# Altium schematic sheet KEYPAD.SchDoc: Air724UG 参考设计
size 594 x 419 mm; DESIGNER: Loukanghua; REV: V1.0
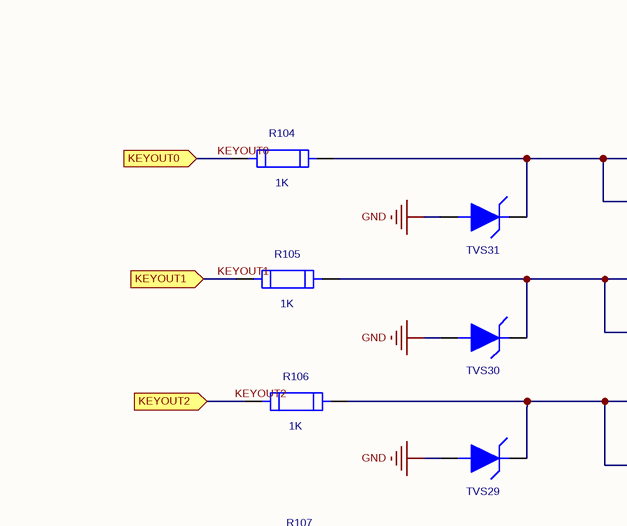
[diagram p0: KEYPAD.SchDoc, top left]
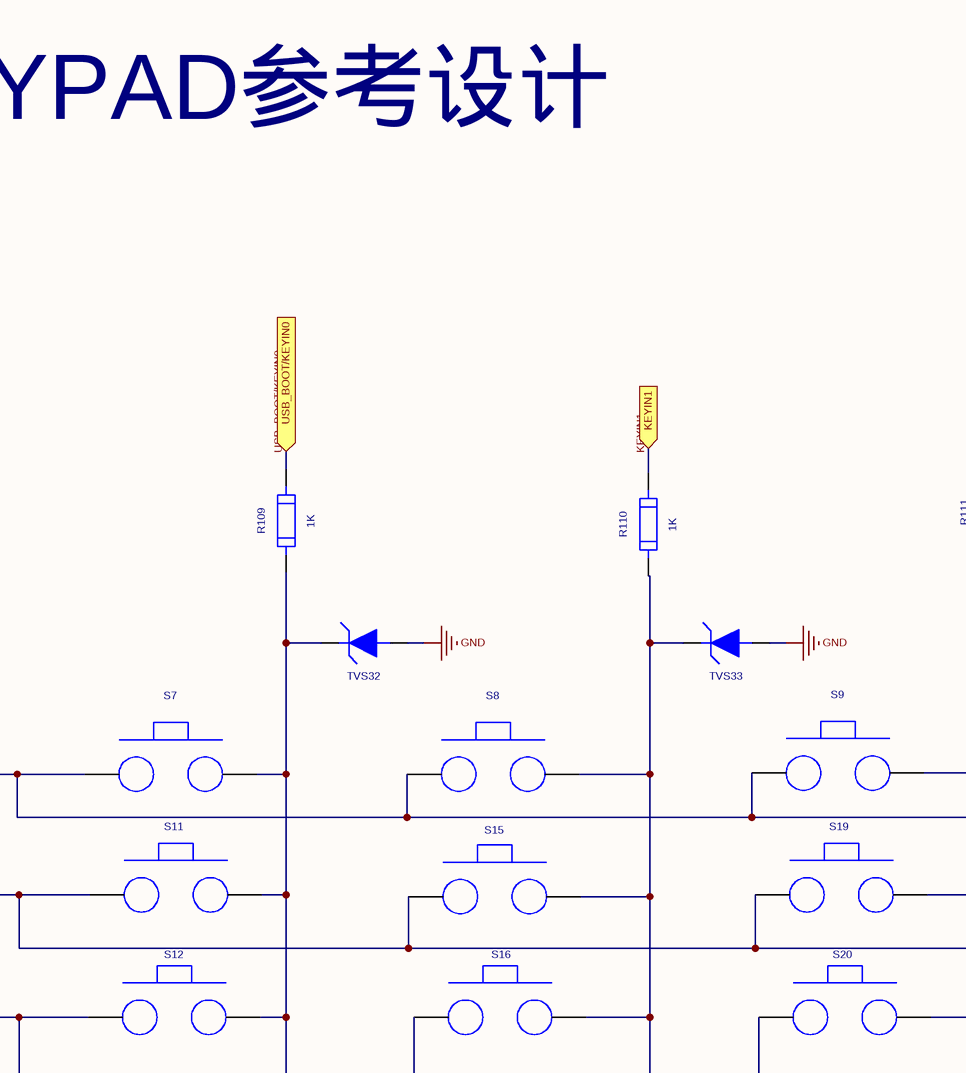
[diagram p1: KEYPAD.SchDoc, top middle]
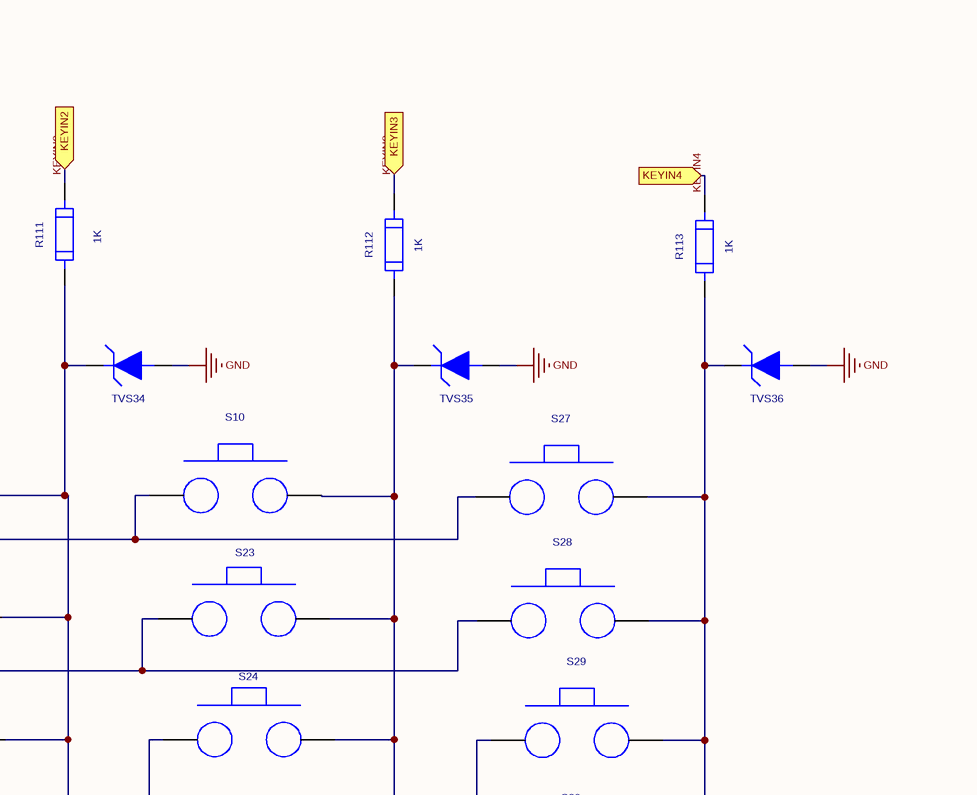
[diagram p2: KEYPAD.SchDoc, top right]
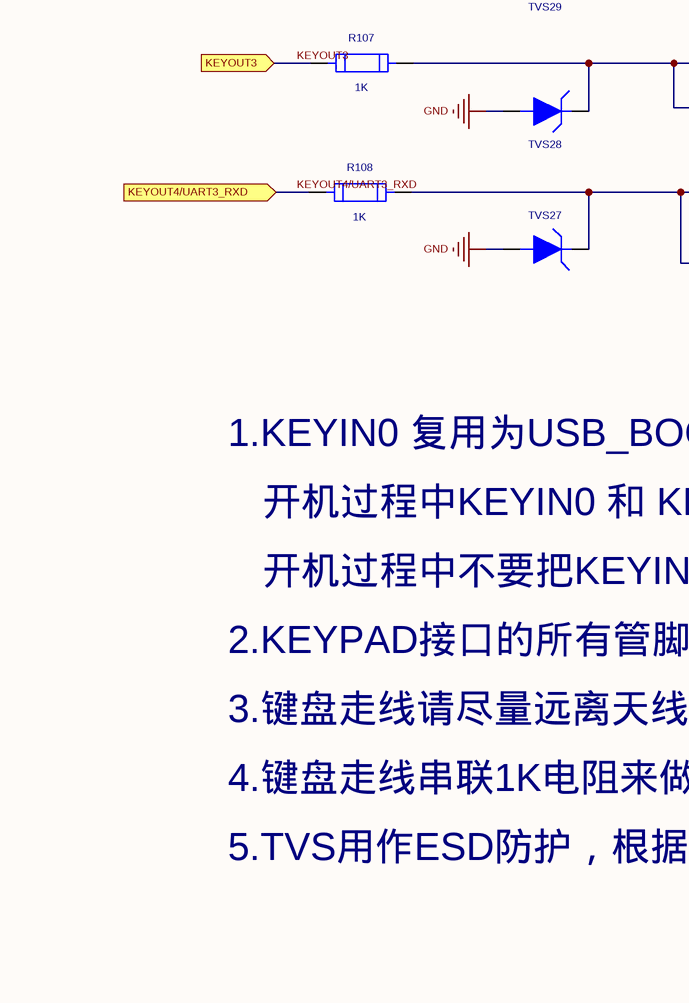
[diagram p3: KEYPAD.SchDoc, bottom left]
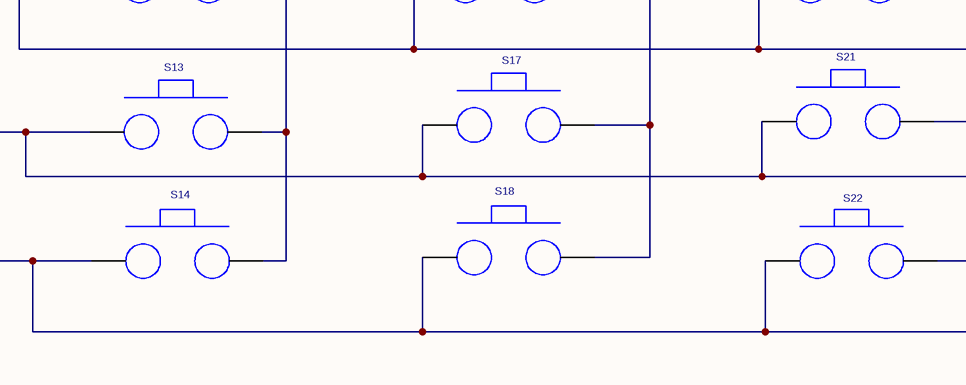
[diagram p4: KEYPAD.SchDoc, bottom middle]
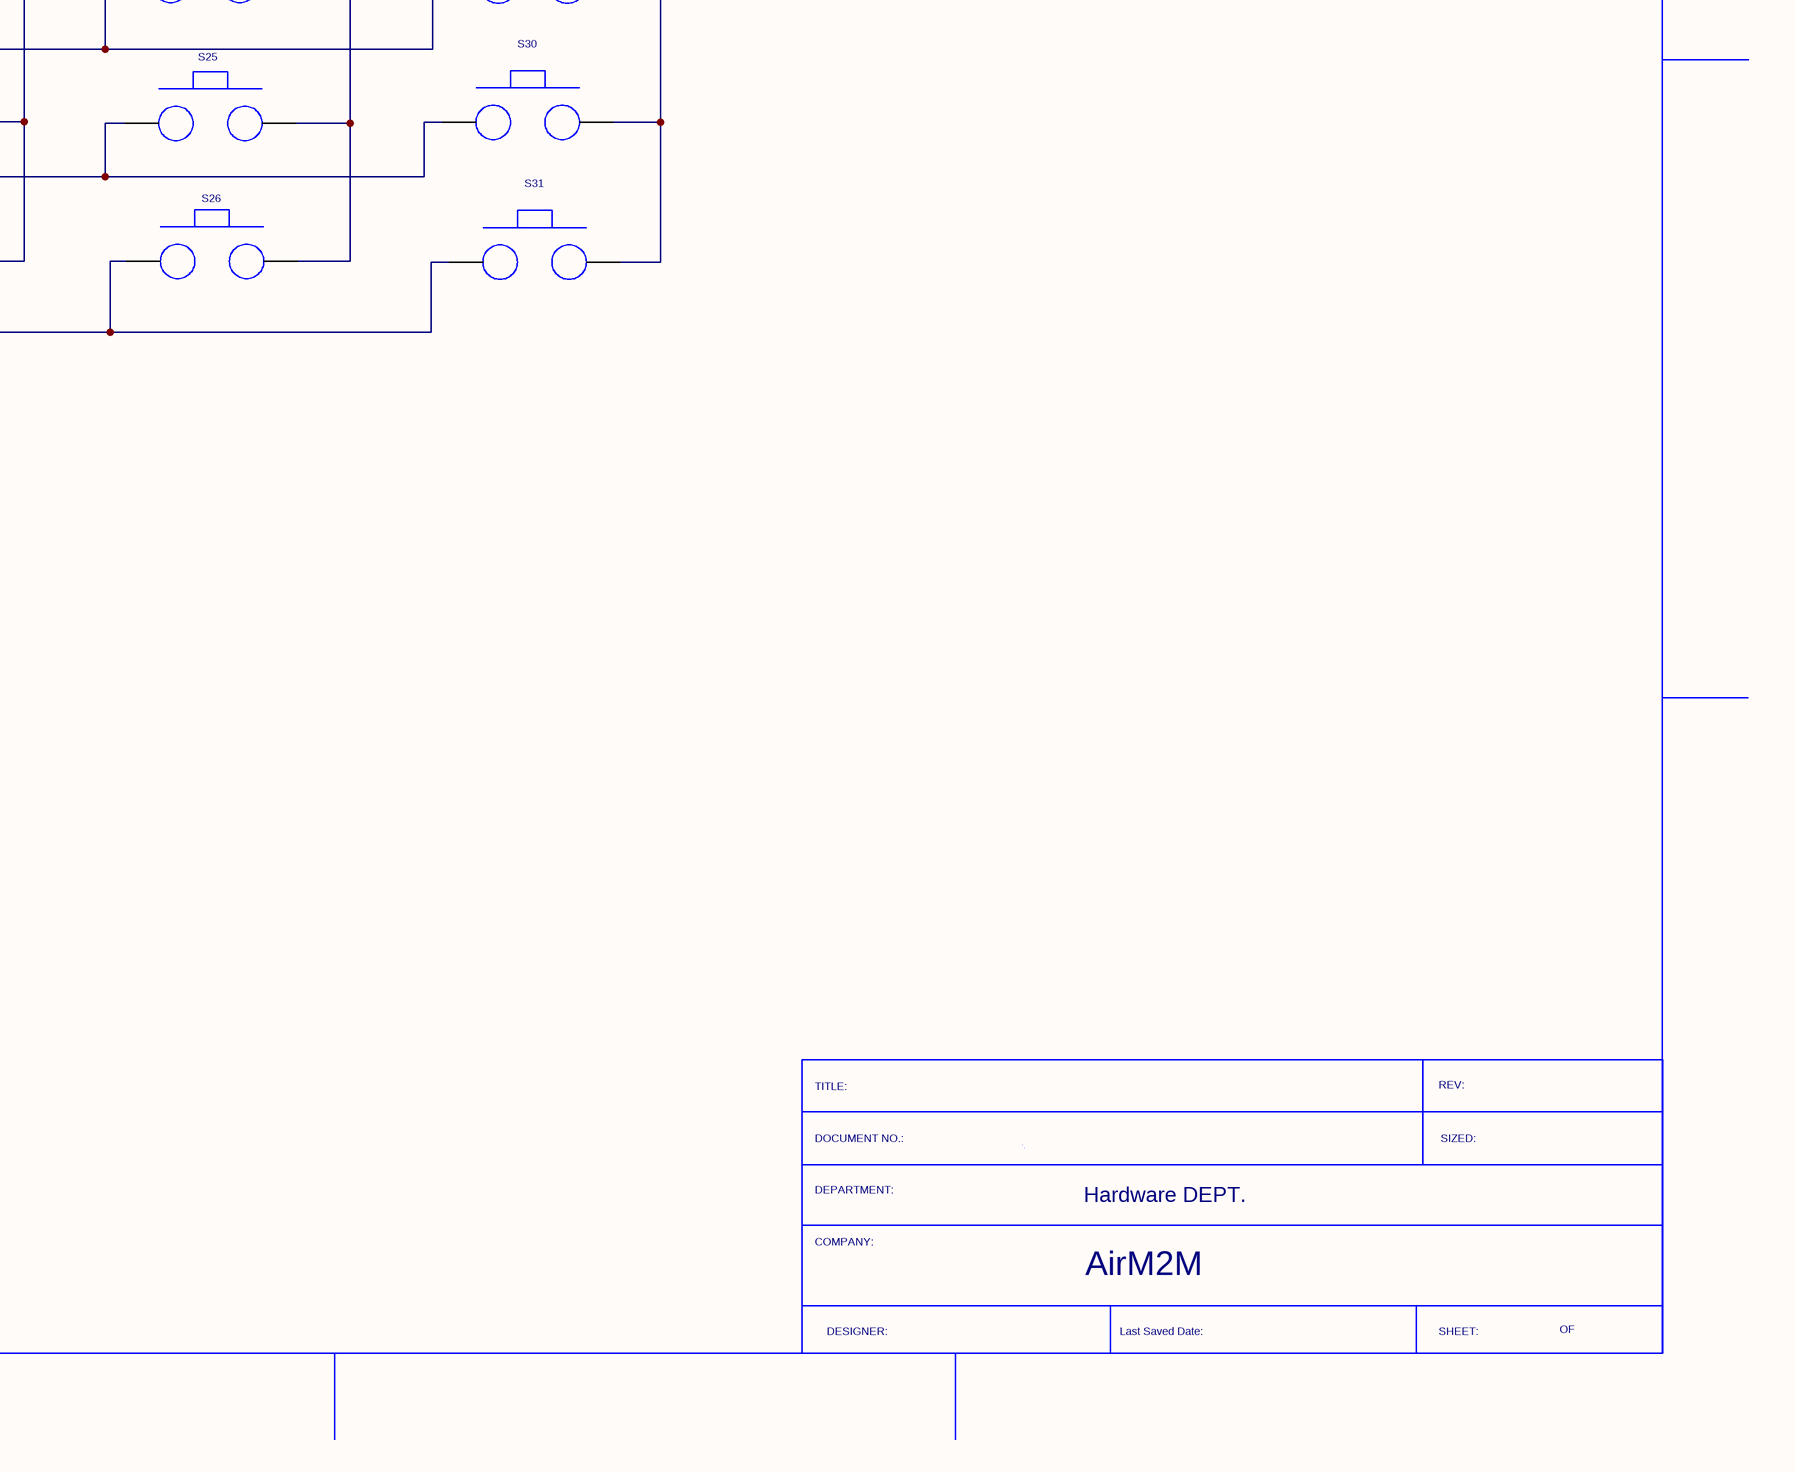
[diagram p5: KEYPAD.SchDoc, bottom right]

## Parts
R104  value 1K  [SR0402]  (hidden comment: RES-1K-+-1%-0402)
R105  value 1K  [SR0402]  (hidden comment: RES-1K-+-1%-0402)
R106  value 1K  [SR0402]  (hidden comment: RES-1K-+-1%-0402)
R107  value 1K  [SR0402]  (hidden comment: RES-1K-+-1%-0402)
R108  value 1K  [SR0402]  (hidden comment: RES-1K-+-1%-0402)
R109  value 1K  [SR0402]  (hidden comment: RES-1K-+-1%-0402)
R110  value 1K  [SR0402]  (hidden comment: RES-1K-+-1%-0402)
R111  value 1K  [SR0402]  (hidden comment: RES-1K-+-1%-0402)
R112  value 1K  [SR0402]  (hidden comment: RES-1K-+-1%-0402)
R113  value 1K  [SR0402]  (hidden comment: RES-1K-+-1%-0402)
S7  KEYPAD-D5X5  [KEY55]  (value not drawn)
S8  KEYPAD-D5X5  [KEY55]  (value not drawn)
S9  KEYPAD-D5X5  [KEY55]  (value not drawn)
S10  KEYPAD-D5X5  [KEY55]  (value not drawn)
S11  KEYPAD-D5X5  [KEY55]  (value not drawn)
S12  KEYPAD-D5X5  [KEY55]  (value not drawn)
S13  KEYPAD-D5X5  [KEY55]  (value not drawn)
S14  KEYPAD-D5X5  [KEY55]  (value not drawn)
S15  KEYPAD-D5X5  [KEY55]  (value not drawn)
S16  KEYPAD-D5X5  [KEY55]  (value not drawn)
S17  KEYPAD-D5X5  [KEY55]  (value not drawn)
S18  KEYPAD-D5X5  [KEY55]  (value not drawn)
S19  KEYPAD-D5X5  [KEY55]  (value not drawn)
S20  KEYPAD-D5X5  [KEY55]  (value not drawn)
S21  KEYPAD-D5X5  [KEY55]  (value not drawn)
S22  KEYPAD-D5X5  [KEY55]  (value not drawn)
S23  KEYPAD-D5X5  [KEY55]  (value not drawn)
S24  KEYPAD-D5X5  [KEY55]  (value not drawn)
S25  KEYPAD-D5X5  [KEY55]  (value not drawn)
S26  KEYPAD-D5X5  [KEY55]  (value not drawn)
S27  KEYPAD-D5X5  [KEY55]  (value not drawn)
S28  KEYPAD-D5X5  [KEY55]  (value not drawn)
S29  KEYPAD-D5X5  [KEY55]  (value not drawn)
S30  KEYPAD-D5X5  [KEY55]  (value not drawn)
S31  KEYPAD-D5X5  [KEY55]  (value not drawn)
TVS27  ESD-TVS-ESD9X5.0ST5G  [SOD-923-ESD9X5.0ST5G]  (value not drawn)
TVS28  ESD-TVS-ESD9X5.0ST5G  [SOD-923-ESD9X5.0ST5G]  (value not drawn)
TVS29  ESD-TVS-ESD9X5.0ST5G  [SOD-923-ESD9X5.0ST5G]  (value not drawn)
TVS30  ESD-TVS-ESD9X5.0ST5G  [SOD-923-ESD9X5.0ST5G]  (value not drawn)
TVS31  ESD-TVS-ESD9X5.0ST5G  [SOD-923-ESD9X5.0ST5G]  (value not drawn)
TVS32  ESD-TVS-ESD9X5.0ST5G  [SOD-923-ESD9X5.0ST5G]  (value not drawn)
TVS33  ESD-TVS-ESD9X5.0ST5G  [SOD-923-ESD9X5.0ST5G]  (value not drawn)
TVS34  ESD-TVS-ESD9X5.0ST5G  [SOD-923-ESD9X5.0ST5G]  (value not drawn)
TVS35  ESD-TVS-ESD9X5.0ST5G  [SOD-923-ESD9X5.0ST5G]  (value not drawn)
TVS36  ESD-TVS-ESD9X5.0ST5G  [SOD-923-ESD9X5.0ST5G]  (value not drawn)

## Ports
KEYIN1, KEYIN2, KEYIN3, KEYIN4, KEYOUT0, KEYOUT1, KEYOUT2, KEYOUT3, KEYOUT4/UART3_RXD, USB_BOOT/KEYIN0

## Nets
GND: TVS27.2 TVS28.2 TVS29.2 TVS30.2 TVS31.2 TVS32.2 TVS33.2 TVS34.2 TVS35.2 TVS36.2
KEYIN1: R110.2 ; port KEYIN1
KEYIN2: R111.2 ; port KEYIN2
KEYIN3: R112.2 ; port KEYIN3
KEYIN4: R113.2 ; port KEYIN4
KEYOUT0: R104.1 ; port KEYOUT0
KEYOUT1: R105.1 ; port KEYOUT1
KEYOUT2: R106.1 ; port KEYOUT2
KEYOUT3: R107.1 ; port KEYOUT3
KEYOUT4/UART3_RXD: R108.1 ; port KEYOUT4/UART3_RXD
USB_BOOT/KEYIN0: R109.2 ; port USB_BOOT/KEYIN0
NetR104_2: R104.2 S7.1 S8.1 S9.1 S10.1 S27.1 TVS31.1
NetR105_2: R105.2 S11.1 S15.1 S19.1 S23.1 S28.1 TVS30.1
NetR106_2: R106.2 S12.1 S16.1 S20.1 S24.1 S29.1 TVS29.1
NetR107_2: R107.2 S13.1 S17.1 S21.1 S25.1 S30.1 TVS28.1
NetR108_2: R108.2 S14.1 S18.1 S22.1 S26.1 S31.1 TVS27.1
NetR109_1: R109.1 S7.2 S11.2 S12.2 S13.2 S14.2 TVS32.1
NetR110_1: R110.1 S8.2 S15.2 S16.2 S17.2 S18.2 TVS33.1
NetR111_1: R111.1 S9.2 S19.2 S20.2 S21.2 S22.2 TVS34.1
NetR112_1: R112.1 S10.2 S23.2 S24.2 S25.2 S26.2 TVS35.1
NetR113_1: R113.1 S27.2 S28.2 S29.2 S30.2 S31.2 TVS36.1

## Notes on the sheet
- KEYPAD参考设计
- 1.KEYIN0 复用为USB_BOOT ，开机过程中如果上拉了KEYIN0会进入下载模式;
- 开机过程中KEYIN0 和 KEYOUT0 短接也会进入下载模式;
- 开机过程中不要把KEYIN1拉高，否则会进入测试模式
- 2.KEYPAD接口的所有管脚不能复用为GPIO;
- 3.键盘走线请尽量远离天线，以免对天线造成干扰；
- 4.键盘走线串联1K电阻来做ESD防护。
- 5.TVS用作ESD防护，根据实际测试情况来决定是否要贴片
- TITLE:
- REV:
- DEPARTMENT:
- DOCUMENT NO.:
- Hardware DEPT.
- SIZED:
- COMPANY:
- AirM2M
- DESIGNER:
- Last Saved Date:
- SHEET:
- OF

## Library data of the parts
R104-R113 = RES-1K-+-1%-0402: RES FILM;1K;+/-1%;1/16W;0402;0.4mm;ROHS; Manufacture 1 P/N: RC0402FR-071KL; Manufacture 1: YAGEO; Serial Number: 80114440035; Tolerance: +/-1%; Geometry.Height: 0.4mm; PCB DECAL: SR0402
S7-S31 = KEYPAD-D5X5: SWITCH-KEYPAD; Geometry.Height: 0.05mm; PCB DECAL: KEY55
TVS27-TVS36 = ESD-TVS-ESD9X5.0ST5G: TVS;5.0V;65PF;SOD?923;ROHS; Manufacture 1: ONSEMI; Geometry.Height: 0.43mm; Serial Number: 81121000001; Manufacture 1 P/N: ESD9X5.0ST5G; PCB DECAL: SOD-923-ESD9X5.0ST5G